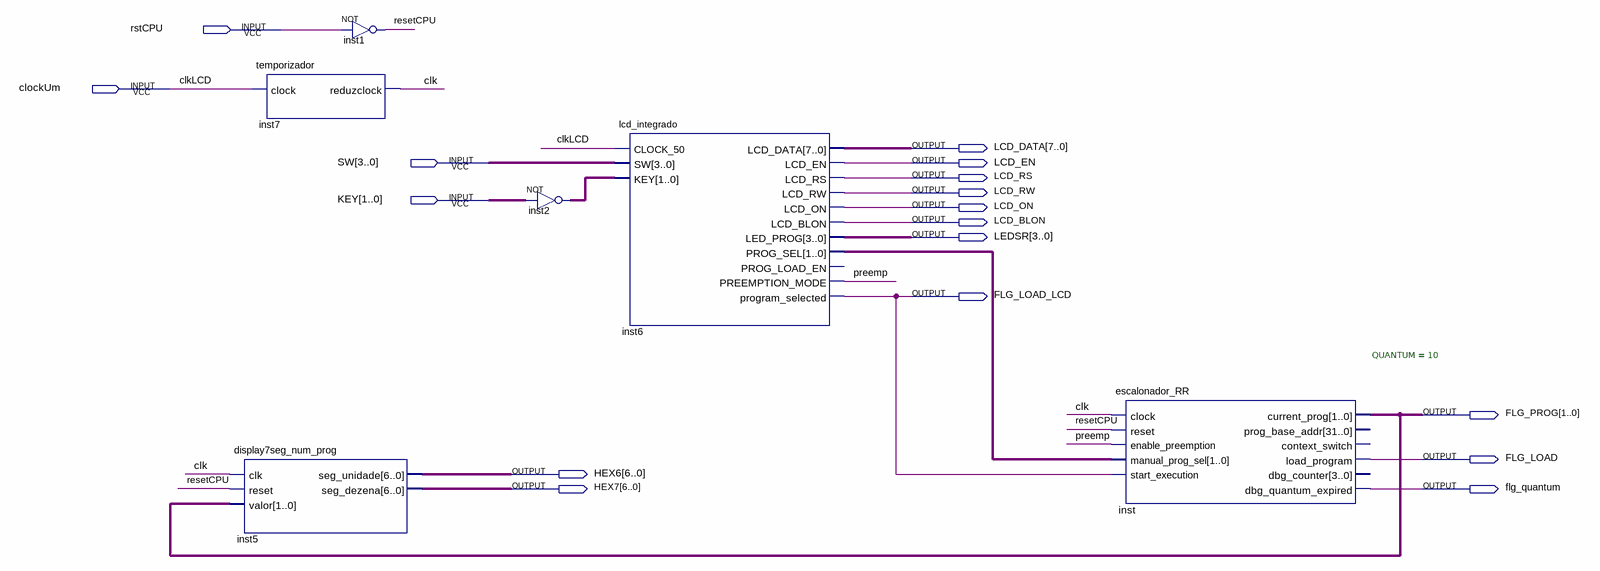
[diagram p0: schematic sheet]
// Quartus schematic testeteste.bdf as structural Verilog: 6 symbols, 17 pins
module testeteste (
  input  rstCPU,
  input  clockUm,
  input  [3:0] SW,
  input  [1:0] KEY,
  output [7:0] LCD_DATA,
  output LCD_EN,
  output LCD_RS,
  output LCD_RW,
  output LCD_ON,
  output LCD_BLON,
  output [3:0] LEDSR,
  output FLG_LOAD_LCD,
  output [1:0] FLG_PROG,
  output FLG_LOAD,
  output [6:0] HEX6,
  output [6:0] HEX7,
  output flg_quantum
);

  wire clk, preemp, resetCPU;
  wire [1:0] inst2_out, inst6_prog_sel;

  temporizador inst7 (.clock(clockUm), .reduzclock(clk));
  display7seg_num_prog inst5 (.clk(clk), .reset(resetCPU), .valor(FLG_PROG), .seg_unidade(HEX6), .seg_dezena(HEX7));
  not inst1 (resetCPU, rstCPU);
  assign inst2_out = ~KEY;  // NOT inst2, 2 bits wide
  lcd_integrado inst6 (
    .CLOCK_50(clockUm), .SW(SW), .KEY(inst2_out), .LCD_DATA(LCD_DATA), .LCD_EN(LCD_EN), .LCD_RS(LCD_RS),
    .LCD_RW(LCD_RW), .LCD_ON(LCD_ON), .LCD_BLON(LCD_BLON), .LED_PROG(LEDSR), .PROG_SEL(inst6_prog_sel),
    .PREEMPTION_MODE(preemp), .program_selected(FLG_LOAD_LCD));  // open: PROG_LOAD_EN
  escalonador_RR #(.QUANTUM(10)) inst (
    .clock(clk), .reset(resetCPU), .enable_preemption(preemp), .manual_prog_sel(inst6_prog_sel),
    .start_execution(FLG_LOAD_LCD), .current_prog(FLG_PROG), .load_program(FLG_LOAD),
    .dbg_quantum_expired(flg_quantum));  // open: prog_base_addr, context_switch, dbg_counter

  // Other names for the same wires on the sheet: clkLCD = clockUm
endmodule
